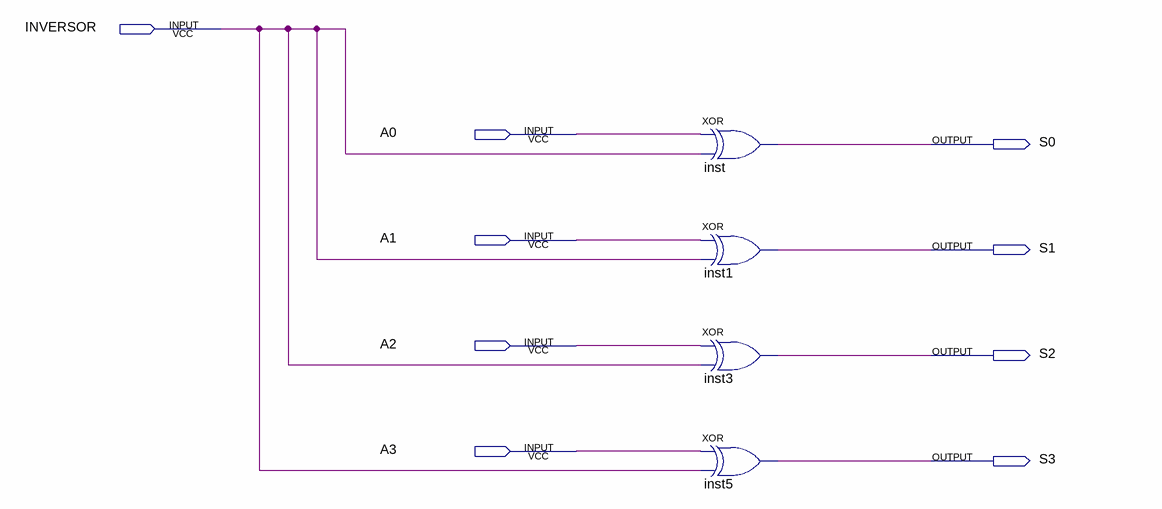
[diagram p0: schematic sheet]
// Quartus schematic InversorLogico.bdf as structural Verilog: 4 symbols, 9 pins
module InversorLogico (
  input  INVERSOR,
  input  A0,
  input  A1,
  input  A2,
  input  A3,
  output S0,
  output S1,
  output S2,
  output S3
);

  xor inst (S0, A0, INVERSOR);
  xor inst1 (S1, A1, INVERSOR);
  xor inst3 (S2, A2, INVERSOR);
  xor inst5 (S3, A3, INVERSOR);
endmodule
